# EAGLE schematic io-board-f-d (EAGLE 8.4.3)
AUTHOR: Balazs Racz; DOCUMENT_NUMBER: none; DRAWING_TITLE: OpenLCB IO Board for Nucleo; LICENSE: Licensed by the Solderpad Hardware Lic. V2.0; REVISION: B; YEAR: 2018
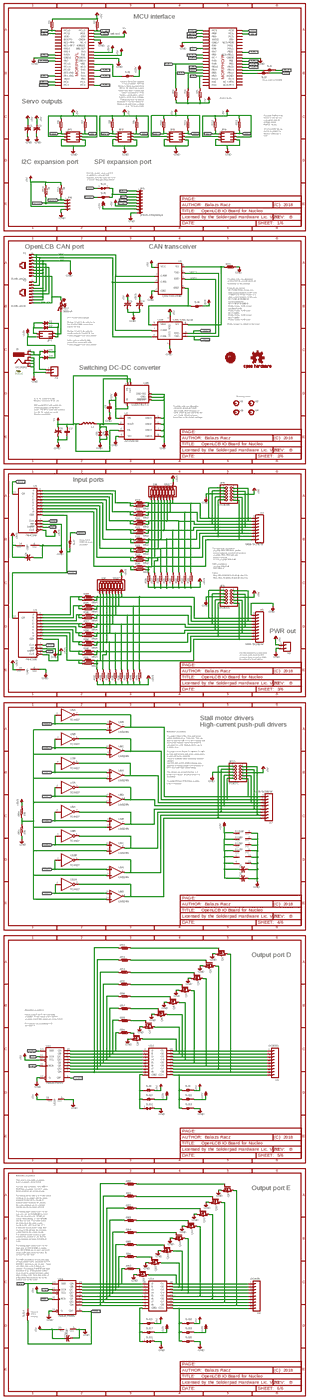
[diagram p0: schematic, sheet 1, overview]
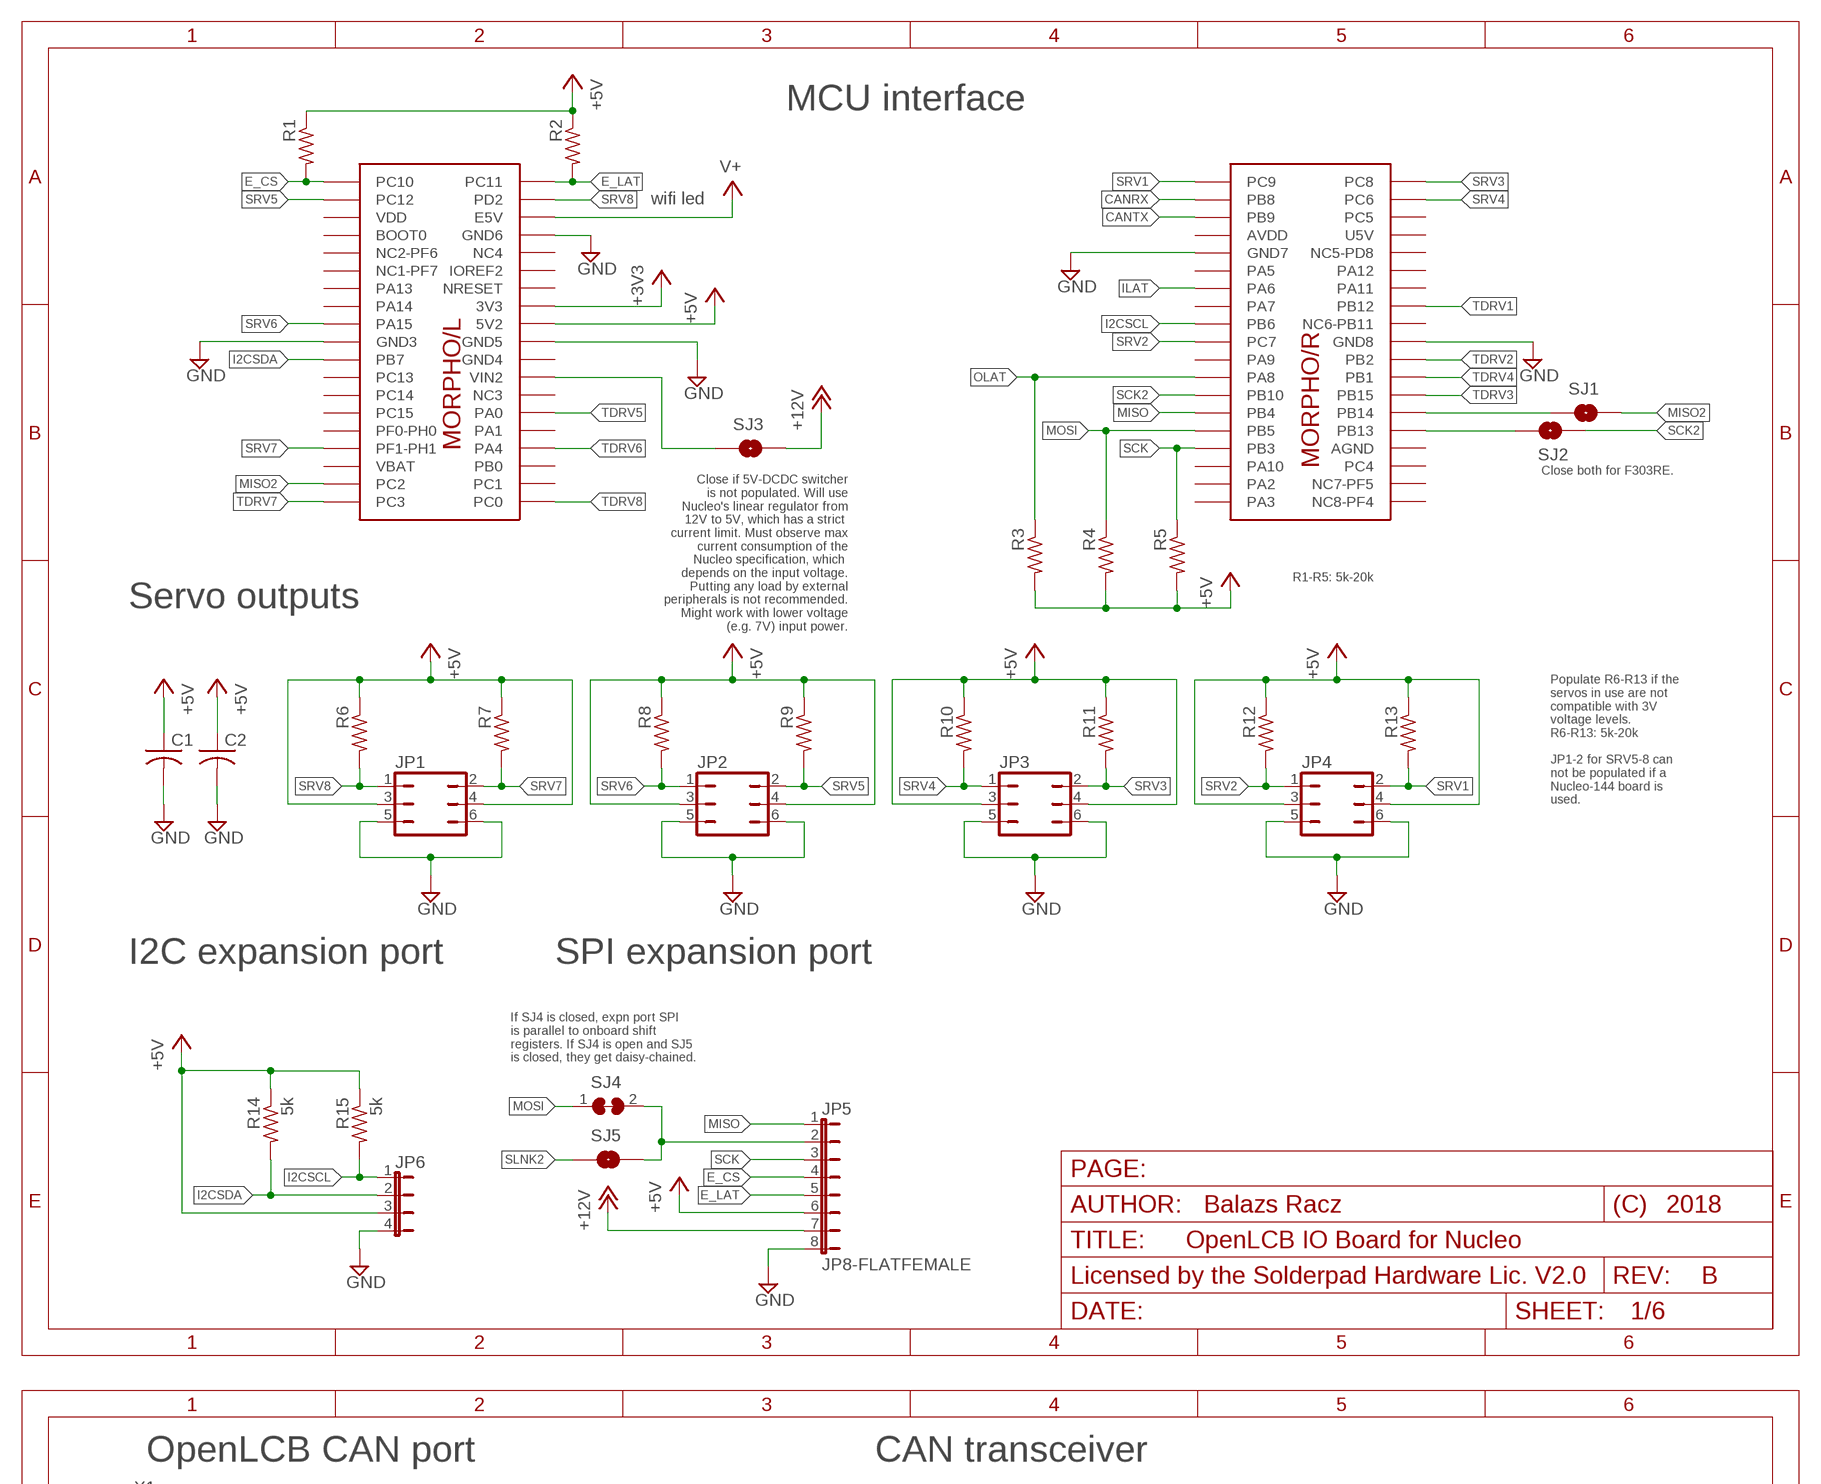
[diagram p1: schematic, sheet 1, part 1 of 4]
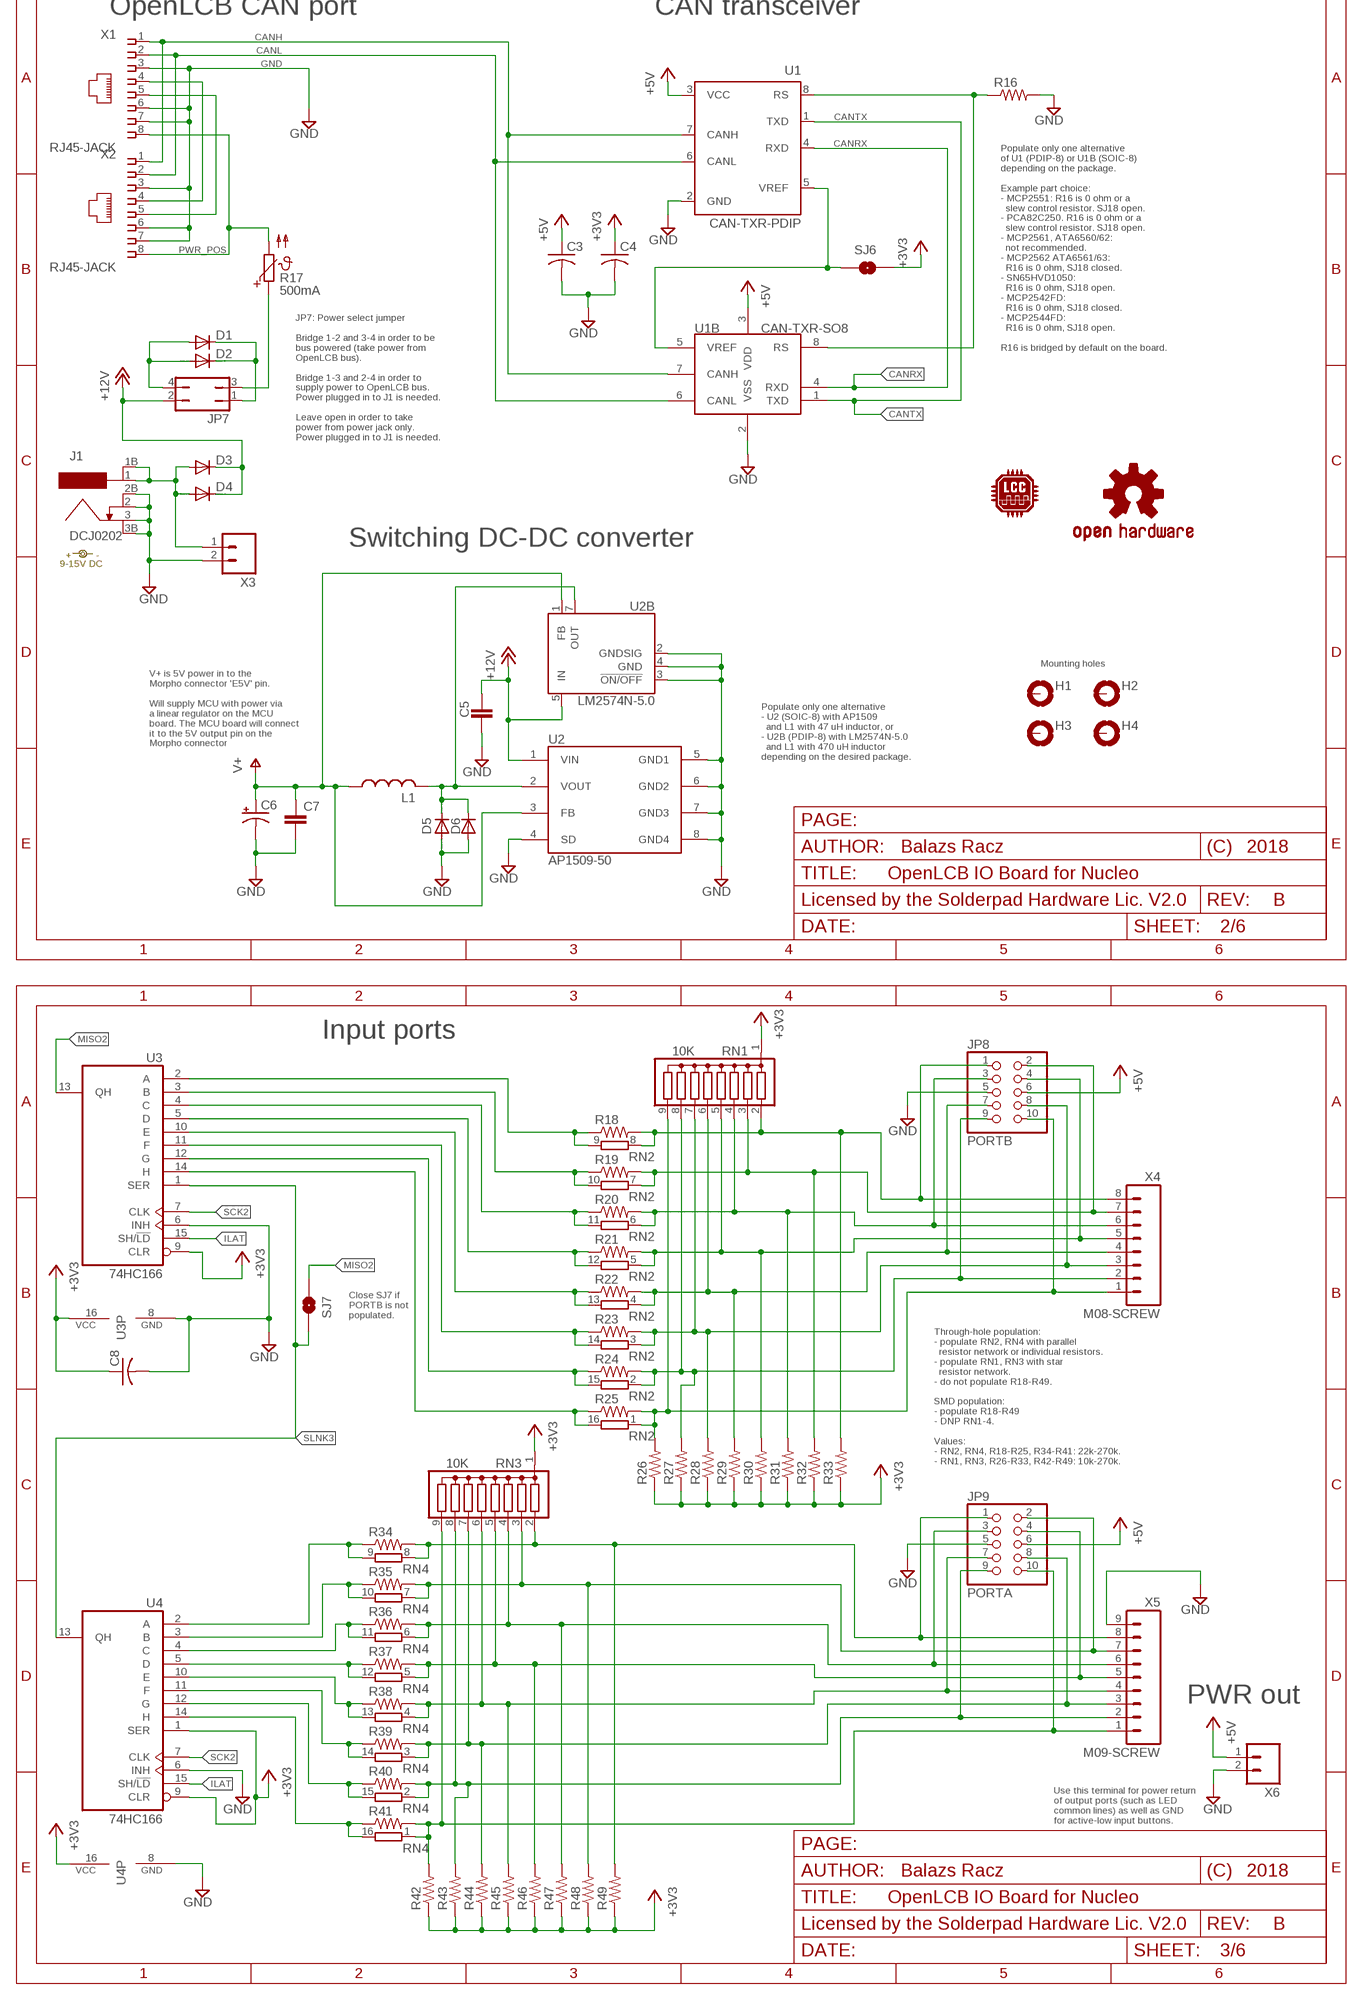
[diagram p2: schematic, sheet 1, part 2 of 4]
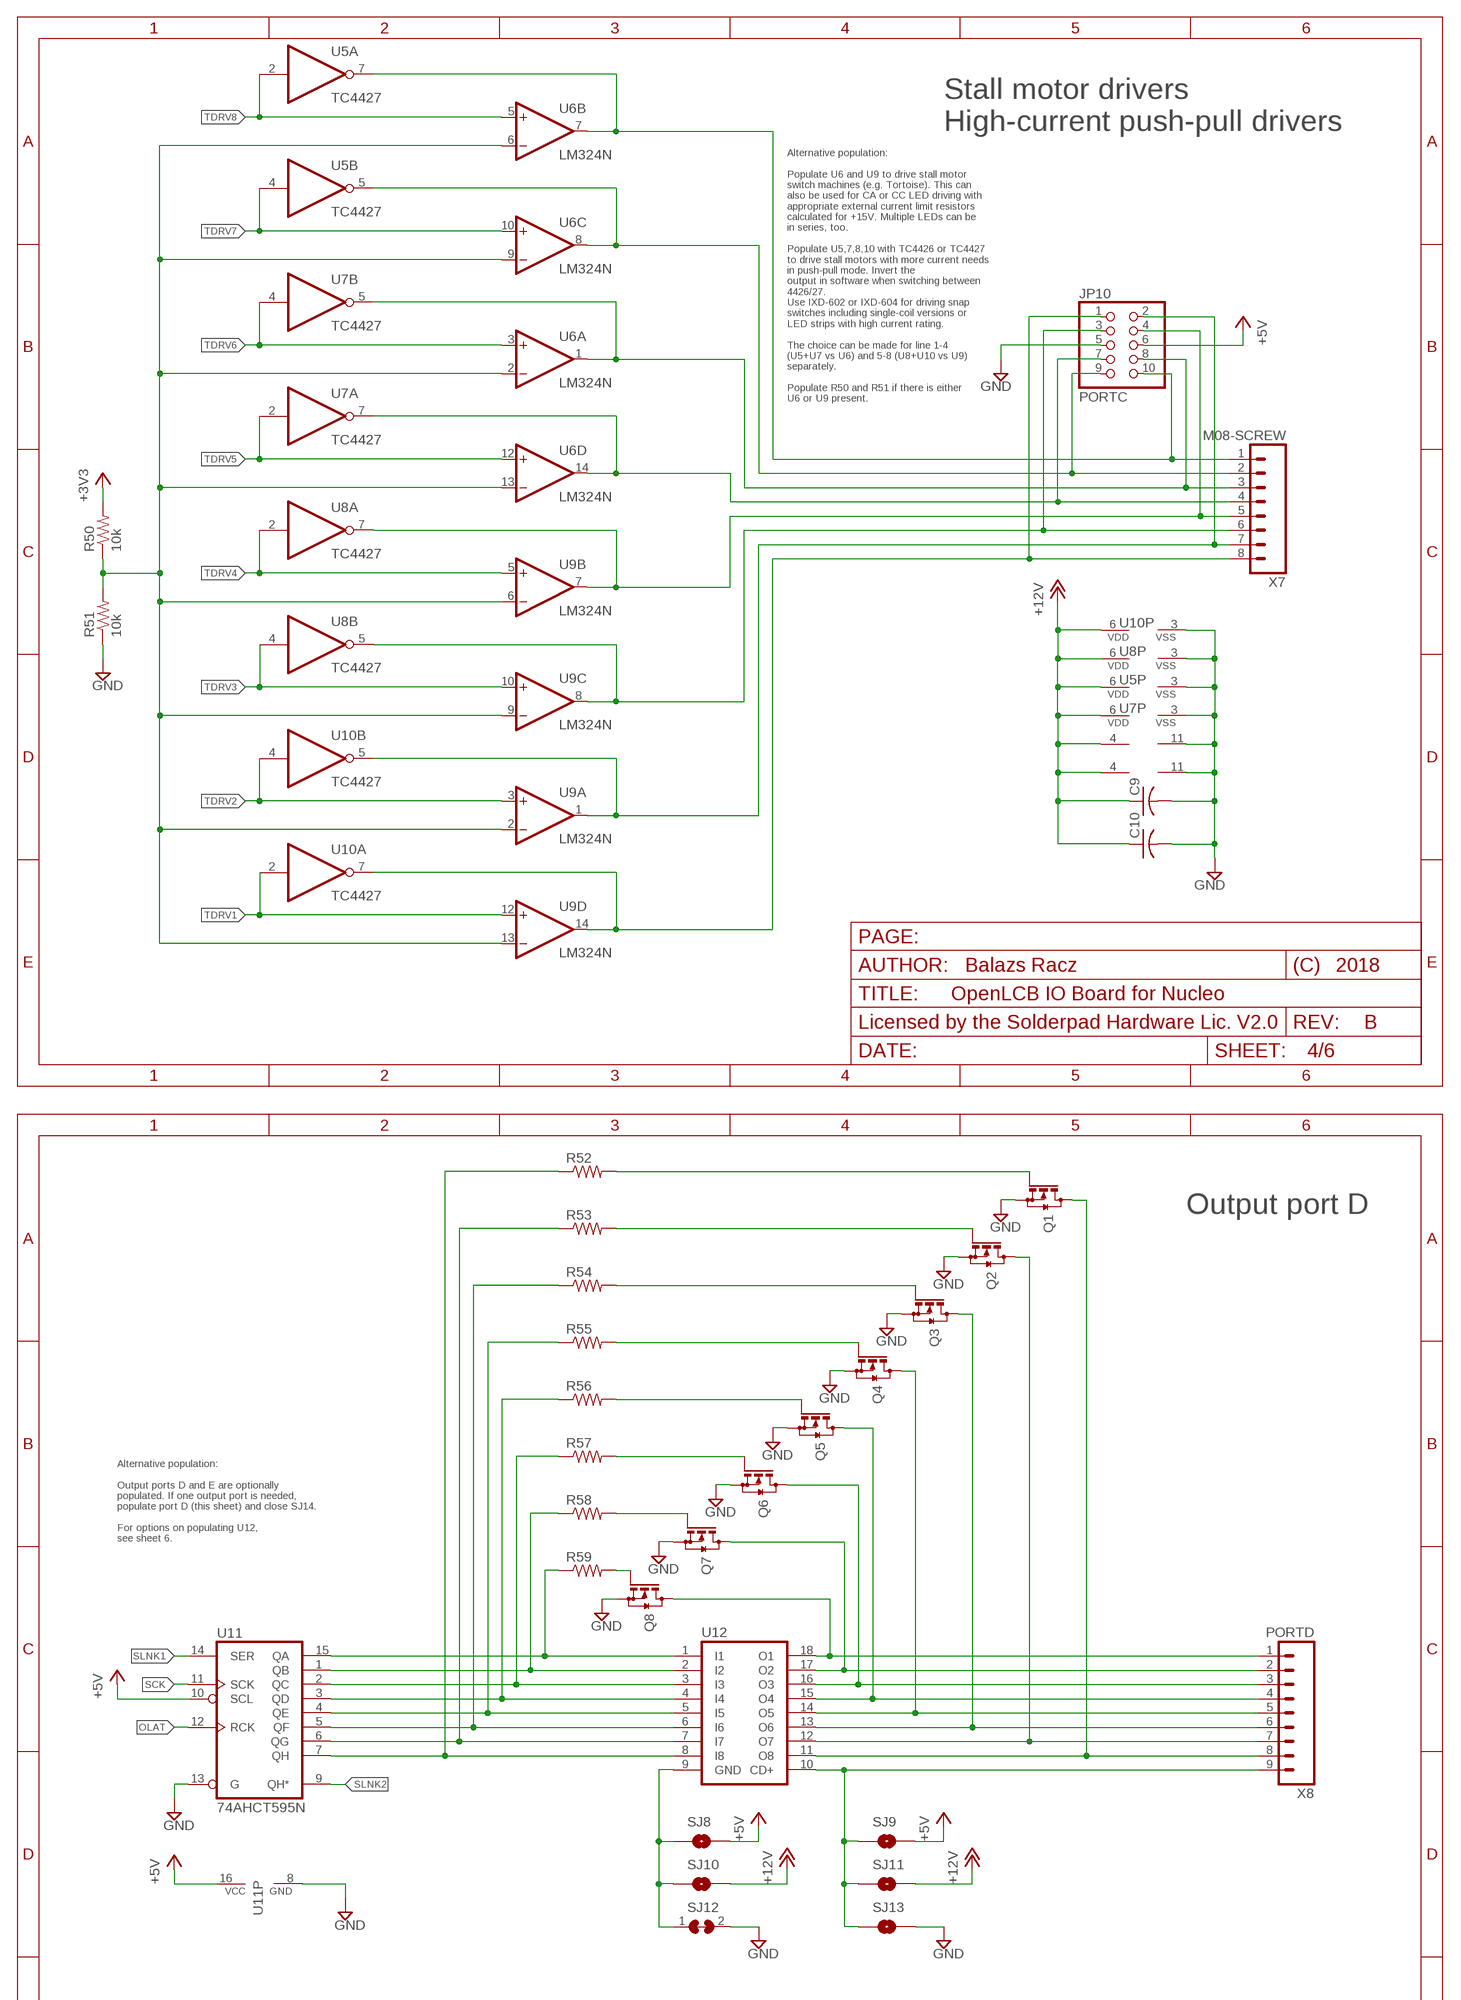
[diagram p3: schematic, sheet 1, part 3 of 4]
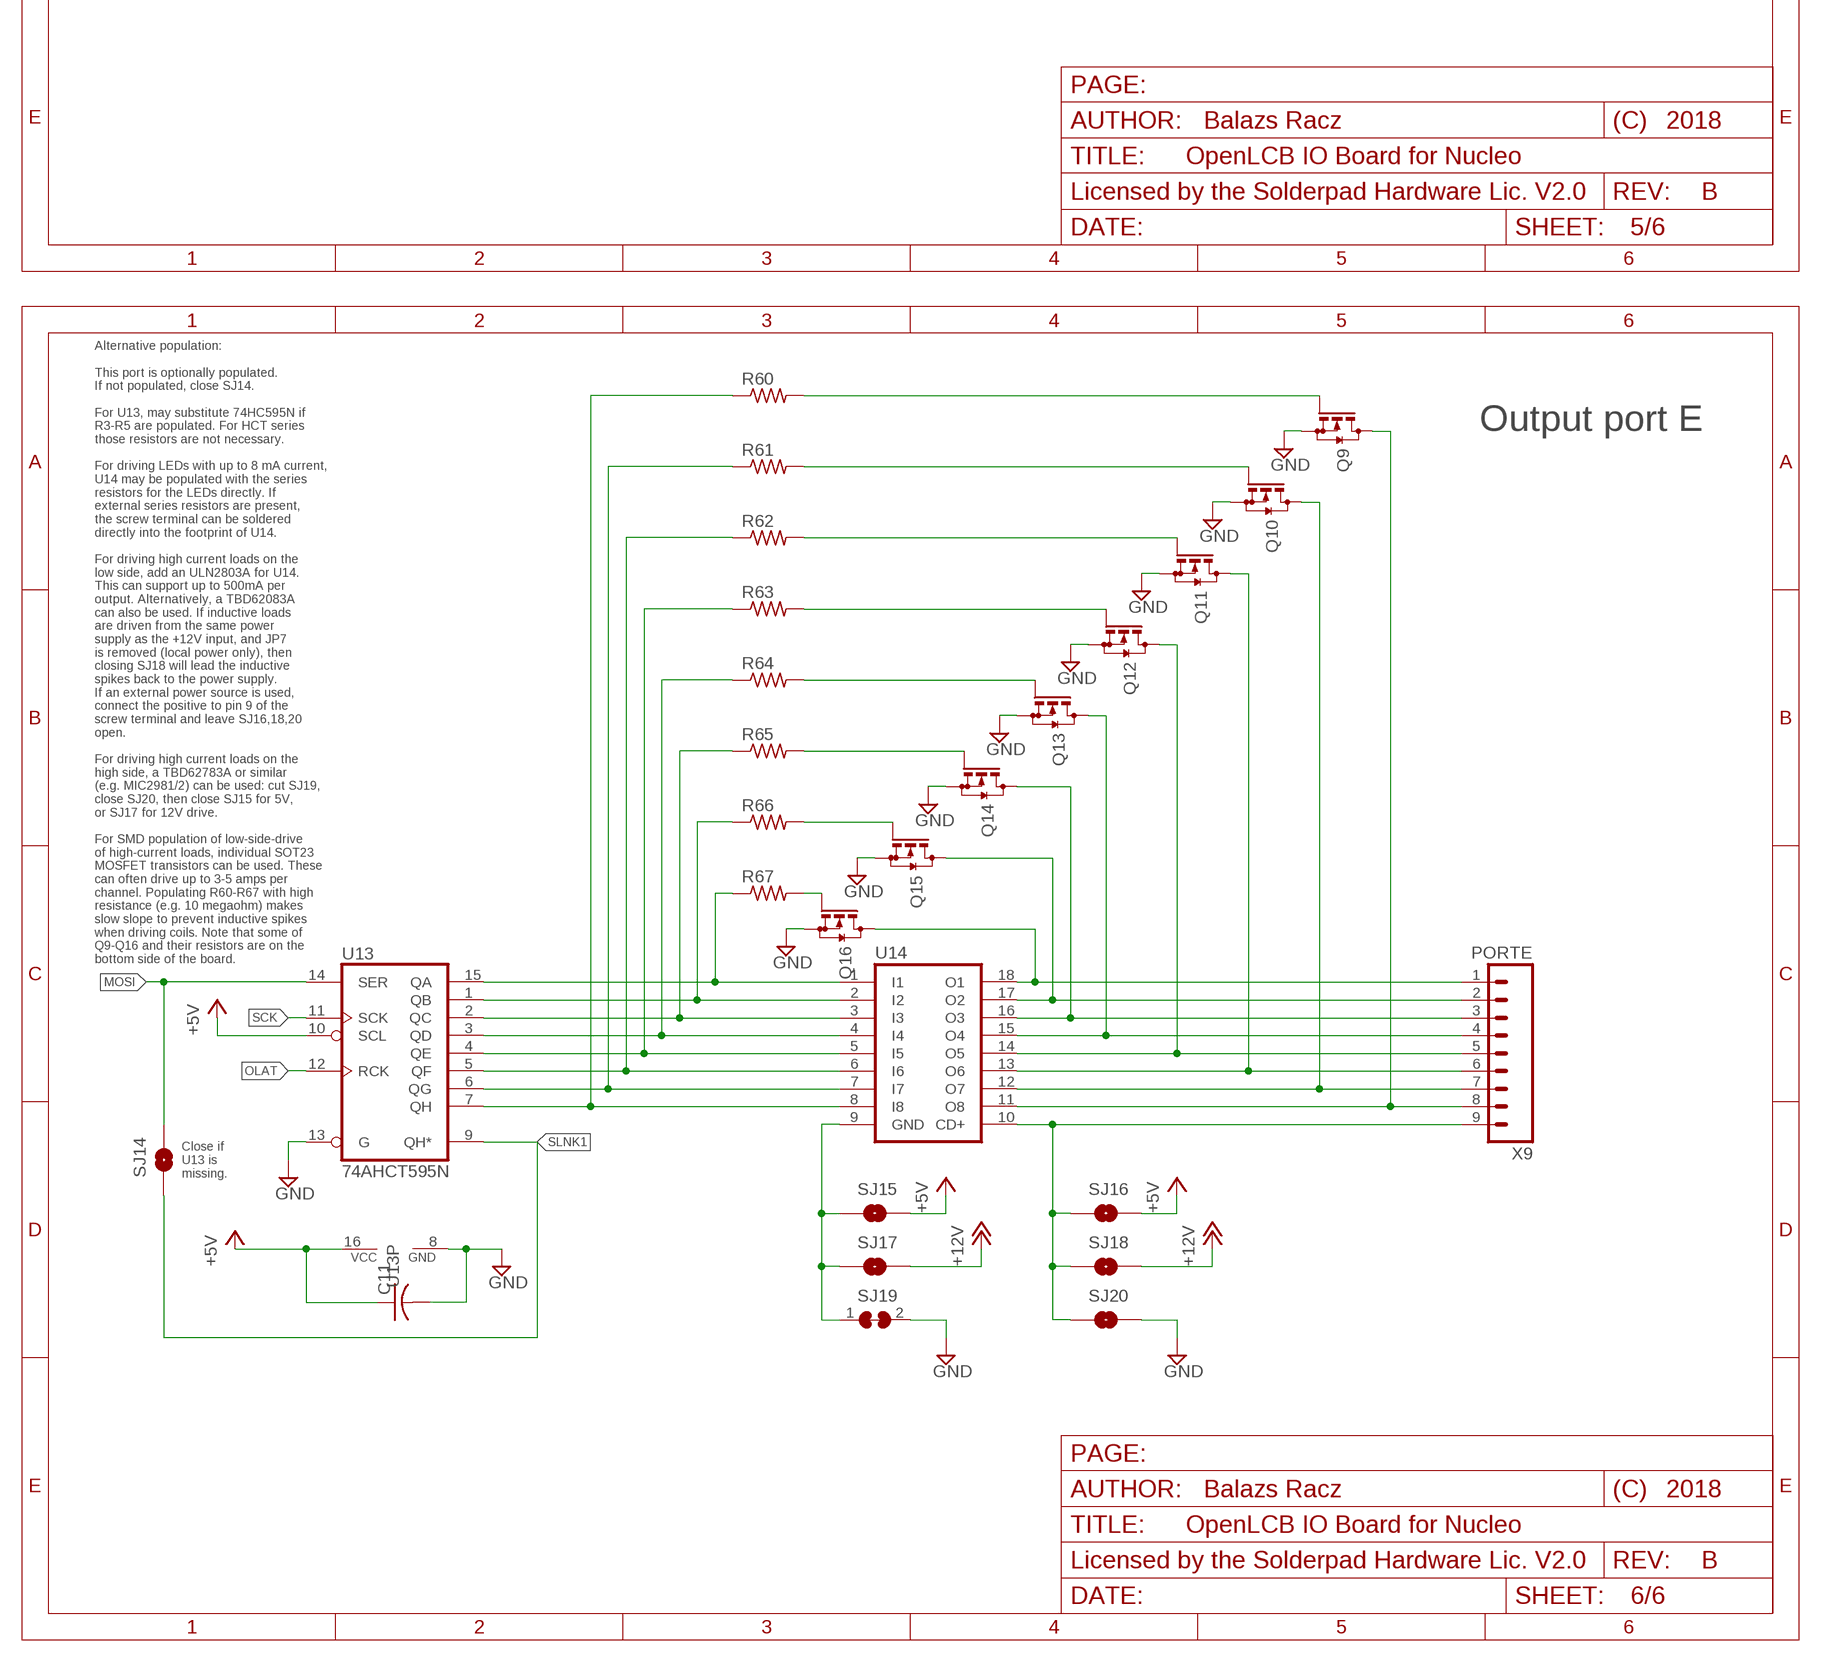
[diagram p4: schematic, sheet 1, part 4 of 4]
FRAME1 (FRAME_A_L): PAGE: MCU interface, servo outputs, expansion port
FRAME2 (FRAME_A_L): PAGE: CAN-bus, power
FRAME3 (FRAME_A_L): PAGE: Input ports
FRAME4 (FRAME_A_L): PAGE: Tortoise drivers and high current drivers
FRAME5 (FRAME_A_L): PAGE: Output port D
FRAME6 (FRAME_A_L): PAGE: Output port E

## Parts
C1  C-USC1206  [C1206]
C2  C-USC1206  [C1206]
C3  C-USC0805  [C0805]
C4  C-USC0805  [C0805]
C5  C-EUC1206  [C1206]
C6  CPOL-USE2.5-5  [E2,5-5]
C7  C-EUC1206  [C1206]
C8  C-USC0805  [C0805]
C9  C-USC1206  [C1206]
C10  C-USC1206  [C1206]
C11  C-USC0805  [C0805]
D1  DIODEDO-214AA-NODOC  [DO214AA-NODOC]
D2  DIODE-DO41-7.6  [DO41-7.6]
D3  DIODEDO-214AA-NODOC  [DO214AA-NODOC]
D4  DIODE-DO41-7.6  [DO41-7.6]
D5  DIODE-DO41-7.6  [DO41-7.6]
D6  DIODEDO-214AA-NODOC  [DO214AA-NODOC]
G1  NUCLEO_64_GENERIC  [NUCLEO_BRD_BASE64]
H1  MOUNT-PAD-ROUND3.3  [3,3-PAD]
H2  MOUNT-PAD-ROUND3.3  [3,3-PAD]
H3  MOUNT-PAD-ROUND3.3  [3,3-PAD]
H4  MOUNT-PAD-ROUND3.3  [3,3-PAD]
J1  DCJ0202  [DCJ0202]
JP1  JP3Q  [JP3Q]
JP2  JP3Q  [JP3Q]
JP3  JP3Q  [JP3Q]
JP4  JP3Q  [JP3Q]
JP5  JP8-FLATFEMALE  [JP8F-FEM]
JP6  JP4-FLAT  [JP4F]
JP7  JP2Q  [JP2Q]
JP8  PORTB  PINHD-2X5CN  [CON10M]
JP9  PORTA  PINHD-2X5CN  [CON10M]
JP10  PORTC  PINHD-2X5CN  [CON10M]
L1  L-US  [L5-8,5]
LG1  LCC_LOGO  [LCC_LOGO]
LOGO1  DOC-OSHW-LOGOM  [OSHW-LOGO-M]
P1  9-15V DC  DOC-POWER_LABEL  [POWER_USAGE]
Q1  BSS123  [SOT23]
Q2  BSS123  [SOT23]
Q3  BSS123  [SOT23]
Q4  BSS123  [SOT23]
Q5  BSS123  [SOT23]
Q6  BSS123  [SOT23]
Q7  BSS123  [SOT23]
Q8  BSS123  [SOT23]
Q9  BSS123  [SOT23]
Q10  BSS123  [SOT23]
Q11  BSS123  [SOT23]
Q12  BSS123  [SOT23]
Q13  BSS123  [SOT23]
Q14  BSS123  [SOT23]
Q15  BSS123  [SOT23]
Q16  BSS123  [SOT23]
R1  R-US_R0805  [R0805]
R2  R-US_R0805  [R0805]
R3  R-US_R0805  [R0805]
R4  R-US_R0805  [R0805]
R5  R-US_R0805  [R0805]
R6  R-US_R0805  [R0805]
R7  R-US_R0805  [R0805]
R8  R-US_R0805  [R0805]
R9  R-US_R0805  [R0805]
R10  R-US_R0805  [R0805]
R11  R-US_R0805  [R0805]
R12  R-US_R0805  [R0805]
R13  R-US_R0805  [R0805]
R14  5k  R-US_R0805  [R0805]
R15  5k  R-US_R0805  [R0805]
R16  R-US_R0805  [R0805]
R17  500mA  PTC_1812  [PTC1812]
R18  R-US_R0603  [R0603]
R19  R-US_R0603  [R0603]
R20  R-US_R0603  [R0603]
R21  R-US_R0603  [R0603]
R22  R-US_R0603  [R0603]
R23  R-US_R0603  [R0603]
R24  R-US_R0603  [R0603]
R25  R-US_R0603  [R0603]
R26  R-US  [R0603]
R27  R-US  [R0603]
R28  R-US  [R0603]
R29  R-US  [R0603]
R30  R-US  [R0603]
R31  R-US  [R0603]
R32  R-US  [R0603]
R33  R-US  [R0603]
R34  R-US_R0603  [R0603]
R35  R-US_R0603  [R0603]
R36  R-US_R0603  [R0603]
R37  R-US_R0603  [R0603]
R38  R-US_R0603  [R0603]
R39  R-US_R0603  [R0603]
R40  R-US_R0603  [R0603]
R41  R-US_R0603  [R0603]
R42  R-US  [R0603]
R43  R-US  [R0603]
R44  R-US  [R0603]
R45  R-US  [R0603]
R46  R-US  [R0603]
R47  R-US  [R0603]
R48  R-US  [R0603]
R49  R-US  [R0603]
R50  10k  R-US_R0805  [R0805]
R51  10k  R-US_R0805  [R0805]
R52  R-US_R0603  [R0603]
R53  R-US_R0603  [R0603]
R54  R-US_R0603  [R0603]
R55  R-US_R0603  [R0603]
R56  R-US_R0603  [R0603]
R57  R-US_R0603  [R0603]
R58  R-US_R0603  [R0603]
R59  R-US_R0603  [R0603]
R60  R-US_R0603  [R0603]
R61  R-US_R0603  [R0603]
R62  R-US_R0603  [R0603]
R63  R-US_R0603  [R0603]
R64  R-US_R0603  [R0603]
R65  R-US_R0603  [R0603]
R66  R-US_R0603  [R0603]
R67  R-US_R0603  [R0603]
RN1  10K  G08R  [SIL9]
RN2  8R-P  [DIL16]
RN3  10K  G08R  [SIL9]
RN4  8R-P  [DIL16]
SJ1  SJRND2  [SJ_RND2]
SJ2  SJRND2  [SJ_RND2]
SJ3  SJRND2  [SJ_RND2]
SJ4  SJ-C  [SJW-C]
SJ5  SJRND2  [SJ_RND2]
SJ6  SJRND2  [SJ_RND2]
SJ7  SJRND2  [SJ_RND2]
SJ8  SJRND2  [SJ_RND2]
SJ9  SJRND2  [SJ_RND2]
SJ10  SJRND2  [SJ_RND2]
SJ11  SJRND2  [SJ_RND2]
SJ12  SJ-C  [SJW-C]
SJ13  SJRND2  [SJ_RND2]
SJ14  SJRND2  [SJ_RND2]
SJ15  SJRND2  [SJ_RND2]
SJ16  SJRND2  [SJ_RND2]
SJ17  SJRND2  [SJ_RND2]
SJ18  SJRND2  [SJ_RND2]
SJ19  SJ-C  [SJW-C]
SJ20  SJRND2  [SJ_RND2]
U1  CAN-TXR-PDIP  PCA82C250  [DIL08]
U1B  CAN-TXR-SO8  MCP2551-SN  [SO-08]
U2  AP1509-50  AP1509  [SO-08]
U2B  LM2574N-5.0  [DIL08]
U3  74HC166  74166N  [DIL16]
U4  74HC166  74166N  [DIL16]
U5  TC4427  TC4426APDIP  [DIL08-LONG]
U6  LM324N  [DIL14]
U7  TC4427  TC4426APDIP  [DIL08-LONG]
U8  TC4427  TC4426APDIP  [DIL08-LONG]
U9  LM324N  [DIL14]
U10  TC4427  TC4426APDIP  [DIL08-LONG]
U11  74AHCT595N  74HCT595N  [DIL16]
U12  ULN2803A  [DIL18-THIN]
U13  74AHCT595N  74HCT595N  [DIL16]
U14  ULN2803A  [DIL18-THIN]
X1  RJ45-JACK  RJ45-JACKRJ45-PULSE-E5J00  [RJ45-PULSE-E5J88]
X2  RJ45-JACK  RJ45-JACKRJ45-PULSE-E5J00  [RJ45-PULSE-E5J88]
X3  CONNECTOR-M023.5MM-LOCK  [SCREWTERMINAL-3.5MM-2_LOCK]
X4  M08-SCREW  [1X08_TERMINAL]
X5  M09-SCREW  [1X09_TERMINAL]
X6  CONNECTOR-M023.5MM-LOCK  [SCREWTERMINAL-3.5MM-2_LOCK]
X7  M08-SCREW  [1X08_TERMINAL]
X8  PORTD  M09-SCREW  [1X09_TERMINAL]
X9  PORTE  M09-SCREW  [1X09_TERMINAL]

## Nets
+3V3: C4.1 C8.1 G1.3V3 R26.1 R27.1 R28.1 R29.1 R30.1 R31.1 R32.1 R33.1 R42.1 R43.1 R44.1 R45.1 R46.1 R47.1 R48.1 R49.1 R50.2 RN1.1 RN3.1 SJ6.P$2 U3.9(CLR) U3.16(VCC) U4.1(SER) U4.9(CLR) U4.16(VCC)
+5V: C1.1 C2.1 C3.1 C11.1 G1.5V2 JP1.3 JP1.4 JP2.3 JP2.4 JP3.3 JP3.4 JP4.3 JP4.4 JP5.6 JP6.3 JP8.6 JP9.6 JP10.6 R1.1 R2.1 R3.2 R4.2 R5.2 R6.1 R7.1 R8.1 R9.1 R10.1 R11.1 R12.1 R13.1 R14.1 R15.1 SJ8.P$2 SJ9.P$2 SJ15.P$2 SJ16.P$2 U1.3(VCC) U1B.3(VDD) U11.10(SCL) U11.16(VCC) U13.10(SCL) U13.16(VCC) X6.1
+12V: C5.1 C9.1 C10.1 D3.C D4.C JP5.7 JP7.2 SJ3.P$2 SJ10.P$2 SJ11.P$2 SJ17.P$2 SJ18.P$2 U2.1(VIN) U2B.5(IN) U5.6(P:VDD) U6.4(P:V+) U7.6(P:VDD) U8.6(P:VDD) U9.4(P:V+) U10.6(P:VDD)
ALT1: X1.4 X2.4
ALT2: X1.5 X2.5
CAN_RS: R16.1 U1.8(RS) U1B.8(RS)
CAN_VIO: SJ6.P$1 U1.5(VREF) U1B.5(VREF)
CANH: U1.7(CANH) U1B.7(CANH) X1.1 X2.1
CANL: U1.6(CANL) U1B.6(CANL) X1.2 X2.2
CANRX: G1.PB8 U1.4(RXD) U1B.4(RXD)
CANTX: G1.PB9 U1.1(TXD) U1B.1(TXD)
CMPREF: R50.1 R51.2 U6.2(A:-IN) U6.6(B:-IN) U6.9(C:-IN) U6.13(D:-IN) U9.2(A:-IN) U9.6(B:-IN) U9.9(C:-IN) U9.13(D:-IN)
E_CS: G1.PC10 JP5.4 R1.2
E_LAT: G1.PC11 JP5.5 R2.2
E_MOSI: JP5.2 SJ4.2 SJ5.P$2
GND: C1.2 C2.2 C3.2 C4.2 C5.2 C6.- C7.2 C8.2 C9.2 C10.2 C11.2 D5.A D6.A G1.GND3 G1.GND5 G1.GND6 G1.GND7 G1.GND8 J1.2 J1.2B J1.3 J1.3B JP1.5 JP1.6 JP2.5 JP2.6 JP3.5 JP3.6 JP4.5 JP4.6 JP5.8 JP6.4 JP8.5 JP9.5 JP10.5 Q1.2(S) Q2.2(S) Q3.2(S) Q4.2(S) Q5.2(S) Q6.2(S) Q7.2(S) Q8.2(S) Q9.2(S) Q10.2(S) Q11.2(S) Q12.2(S) Q13.2(S) Q14.2(S) Q15.2(S) Q16.2(S) R16.2 R51.1 SJ12.2 SJ13.P$2 SJ19.2 SJ20.P$2 U1.2(GND) U1B.2(VSS) U2.4(SD) U2.5(GND1) U2.6(GND2) U2.7(GND3) U2.8(GND4) U2B.2(GNDSIG) U2B.3(!ON/OFF) U2B.4(GND) U3.6(INH) U3.8(GND) U4.6(INH) U4.8(GND) U5.3(P:VSS) U6.11(P:V-) U7.3(P:VSS) U8.3(P:VSS) U9.11(P:V-) U10.3(P:VSS) U11.8(GND) U11.13(G) U13.8(GND) U13.13(G) X1.3 X1.6 X1.7 X2.3 X2.6 X2.7 X3.2 X5.9 X6.2
I2CSCL: G1.PB6 JP6.1 R15.2
I2CSDA: G1.PB7 JP6.2 R14.2
ILAT: G1.PA6 U3.15(SH/!LD) U4.15(SH/!LD)
LPOWA: SJ8.P$1 SJ10.P$1 SJ12.1 U12.9(GND)
LPOWB: SJ9.P$1 SJ11.P$1 SJ13.P$1 U12.10(CD+) X8.9
MISO: G1.PB4 JP5.1
MISO2: G1.PC2 SJ1.P$2 SJ7.P$2 U3.13(QH)
MISO2_ALT: G1.PB14 SJ1.P$1
MOSI: G1.PB5 R4.1 SJ4.1 SJ14.P$2 U13.14(SER)
N$1: R67.1 U13.15(QA) U14.1(I1)
N$2: Q16.3(D) U14.18(O1) X9.1
N$3: R66.1 U13.1(QB) U14.2(I2)
N$4: D3.A D4.A J1.1 J1.1B X3.1
N$5: JP8.10 R25.2 R26.2 RN1.9 RN2.1 X4.1
N$6: JP9.1 R34.2 R49.2 RN3.2 RN4.8 X5.8
N$7: Q15.3(D) U14.17(O2) X9.2
N$8: R65.1 U13.2(QC) U14.3(I3)
N$9: Q14.3(D) U14.16(O3) X9.3
N$10: R64.1 U13.3(QD) U14.4(I4)
N$11: Q13.3(D) U14.15(O4) X9.4
N$12: R63.1 U13.4(QE) U14.5(I5)
N$13: Q12.3(D) U14.14(O5) X9.5
N$14: JP9.2 R35.2 R48.2 RN3.3 RN4.7 X5.7
N$15: JP9.3 R36.2 R47.2 RN3.4 RN4.6 X5.6
N$16: Q13.1(G) R64.2
N$17: R62.1 U13.5(QF) U14.6(I6)
N$18: Q11.3(D) U14.13(O6) X9.6
N$19: JP9.7 R38.2 R45.2 RN3.6 RN4.4 X5.4
N$20: JP9.8 R39.2 R44.2 RN3.7 RN4.3 X5.3
N$21: JP8.3 R20.2 R31.2 RN1.4 RN2.6 X4.6
N$22: JP9.10 R41.2 R42.2 RN3.9 RN4.1 X5.1
N$23: R34.1 RN4.9 U4.2(A)
N$24: R35.1 RN4.10 U4.3(B)
N$25: JP8.1 R18.2 R33.2 RN1.2 RN2.8 X4.8
N$26: JP8.2 R19.2 R32.2 RN1.3 RN2.7 X4.7
N$27: Q12.1(G) R63.2
N$28: JP8.4 R21.2 R30.2 RN1.5 RN2.5 X4.5
N$29: R36.1 RN4.11 U4.4(C)
N$30: R37.1 RN4.12 U4.5(D)
N$31: R38.1 RN4.13 U4.10(E)
N$32: R39.1 RN4.14 U4.11(F)
N$33: JP8.7 R22.2 R29.2 RN1.6 RN2.4 X4.4
N$34: JP8.8 R23.2 R28.2 RN1.7 RN2.3 X4.3
N$35: JP8.9 R24.2 R27.2 RN1.8 RN2.2 X4.2
N$37: R40.1 RN4.15 U4.12(G)
N$38: R41.1 RN4.16 U4.14(H)
N$39: R61.1 U13.6(QG) U14.7(I7)
N$40: Q10.3(D) U14.12(O7) X9.7
N$41: R60.1 U13.7(QH) U14.8(I8)
N$42: Q9.3(D) U14.11(O8) X9.8
N$43: Q11.1(G) R62.2
N$44: R18.1 RN2.9 U3.2(A)
N$45: D1.C D2.C JP7.1
N$46: D1.A D2.A JP7.4
N$47: R19.1 RN2.10 U3.3(B)
N$48: R20.1 RN2.11 U3.4(C)
N$49: R21.1 RN2.12 U3.5(D)
N$50: R22.1 RN2.13 U3.10(E)
N$51: R23.1 RN2.14 U3.11(F)
N$52: R24.1 RN2.15 U3.12(G)
N$53: R25.1 RN2.16 U3.14(H)
N$56: R59.1 U11.15(QA) U12.1(I1)
N$57: JP7.3 R17.1
N$60: G1.VIN2 SJ3.P$1
N$65: Q10.1(G) R61.2
N$75: Q1.3(D) U12.11(O8) X8.8
N$78: Q16.1(G) R67.2
N$79: Q15.1(G) R66.2
N$83: JP9.4 R37.2 R46.2 RN3.5 RN4.5 X5.5
N$84: JP9.9 R40.2 R43.2 RN3.8 RN4.2 X5.2
N$85: Q9.1(G) R60.2
N$87: Q8.3(D) U12.18(O1) X8.1
N$88: Q14.1(G) R65.2
N$89: R58.1 U11.1(QB) U12.2(I2)
N$91: Q7.3(D) U12.17(O2) X8.2
N$92: R57.1 U11.2(QC) U12.3(I3)
N$93: Q6.3(D) U12.16(O3) X8.3
N$94: R56.1 U11.3(QD) U12.4(I4)
N$95: Q5.3(D) U12.15(O4) X8.4
N$96: R55.1 U11.4(QE) U12.5(I5)
N$97: Q4.3(D) U12.14(O5) X8.5
N$98: R54.1 U11.5(QF) U12.6(I6)
N$99: Q3.3(D) U12.13(O6) X8.6
N$100: R53.1 U11.6(QG) U12.7(I7)
N$101: Q2.3(D) U12.12(O7) X8.7
N$102: R52.1 U11.7(QH) U12.8(I8)
N$104: Q8.1(G) R59.2
N$105: Q7.1(G) R58.2
N$106: Q6.1(G) R57.2
N$107: Q5.1(G) R56.2
N$108: Q4.1(G) R55.2
N$109: Q3.1(G) R54.2
N$110: Q2.1(G) R53.2
N$111: Q1.1(G) R52.2
OLAT: G1.PA8 R3.1 U11.12(RCK) U13.12(RCK)
PWR_POS: R17.2 X1.8 X2.8
RPOWA: SJ15.P$1 SJ17.P$1 SJ19.1 U14.9(GND)
RPOWB: SJ16.P$1 SJ18.P$1 SJ20.P$1 U14.10(CD+) X9.9
SCK: G1.PB3 JP5.3 R5.1 U11.11(SCK) U13.11(SCK)
SCK2: G1.PB10 SJ2.P$1 U3.7(CLK) U4.7(CLK)
SCK2_ALT: G1.PB13 SJ2.P$2
SLNK1: SJ14.P$1 U11.14(SER) U13.9(QH*)
SLNK2: SJ5.P$1 U11.9(QH*)
SLNK3: SJ7.P$1 U3.1(SER) U4.13(QH)
SRV1: G1.PC9 JP4.2 R13.2
SRV2: G1.PC7 JP4.1 R12.2
SRV3: G1.PC8 JP3.2 R11.2
SRV4: G1.PC6 JP3.1 R10.2
SRV5: G1.PC12 JP2.2 R9.2
SRV6: G1.PA15 JP2.1 R8.2
SRV7: G1.PF1-PH1 JP1.2 R7.2
SRV8: G1.PD2 JP1.1 R6.2
SW: D5.C D6.C L1.2 U2.2(VOUT) U2B.7(OUT)
TDRV1: G1.PB12 U9.12(D:+IN) U10.2(A:I)
TDRV2: G1.PB2 U9.3(A:+IN) U10.4(B:I)
TDRV3: G1.PB15 U8.4(B:I) U9.10(C:+IN)
TDRV4: G1.PB1 U8.2(A:I) U9.5(B:+IN)
TDRV5: G1.PA0 U6.12(D:+IN) U7.2(A:I)
TDRV6: G1.PA4 U6.3(A:+IN) U7.4(B:I)
TDRV7: G1.PC3 U5.4(B:I) U6.10(C:+IN)
TDRV8: G1.PC0 U5.2(A:I) U6.5(B:+IN)
TOUT1: JP10.10 U5.7(A:O) U6.7(B:OUT) X7.1
TOUT2: JP10.9 U5.5(B:O) U6.8(C:OUT) X7.2
TOUT3: JP10.8 U6.1(A:OUT) U7.5(B:O) X7.3
TOUT4: JP10.7 U6.14(D:OUT) U7.7(A:O) X7.4
TOUT5: JP10.4 U8.7(A:O) U9.7(B:OUT) X7.5
TOUT6: JP10.3 U8.5(B:O) U9.8(C:OUT) X7.6
TOUT7: JP10.2 U9.1(A:OUT) U10.5(B:O) X7.7
TOUT8: JP10.1 U9.14(D:OUT) U10.7(A:O) X7.8
V+: C6.+ C7.1 G1.E5V L1.1 U2.3(FB) U2B.1(FB)
Unconnected: G1.BOOT0 G1.IOREF2 G1.NC1-PF7 G1.NC2-PF6 G1.NC3 G1.NC4 G1.NC5-PD8 G1.NC6-PB11 G1.NC7-PF5 G1.NC8-PF4 G1.NRESET G1.PA1 G1.PA2 G1.PA3 G1.PA5 G1.PA7 G1.PA9 G1.PA10 G1.PA11 G1.PA12 G1.PA13 G1.PA14 G1.PB0 G1.PC1 G1.PC4 G1.PC5 G1.PC13 G1.PC14 G1.PC15 G1.PF0-PH0 H1.B3,3(MOUNT) H2.B3,3(MOUNT) H3.B3,3(MOUNT) H4.B3,3(MOUNT)

## Notes on the sheet
- MCU interface
- wifi led
- Close if 5V-DCDC switcher
  is not populated. Will use
  Nucleo's linear regulator from
  12V to 5V, which has a strict 
  current limit. Must observe max
  current consumption of the
  Nucleo specification, which 
  depends on the input voltage.
  Putting any load by external
  peripherals is not recommended.
  Might work with lower voltage
  (e.g. 7V) input power.
- Close both for F303RE.
- R1-R5: 5k-20k
- Servo outputs
- Populate R6-R13 if the
  servos in use are not
  compatible with 3V
  voltage levels.
  R6-R13: 5k-20k
  
  JP1-2 for SRV5-8 can
  not be populated if a
  Nucleo-144 board is
  used.
- I2C expansion port | SPI expansion port
- If SJ4 is closed, expn port SPI
  is parallel to onboard shift
  registers. If SJ4 is open and SJ5
  is closed, they get daisy-chained.
- OpenLCB CAN port | CAN transceiver
- Populate only one alternative 
  of U1 (PDIP-8) or U1B (SOIC-8) 
  depending on the package.
  
  Example part choice:
  - MCP2551: R16 is 0 ohm or a 
    slew control resistor. SJ18 open.
  - PCA82C250. R16 is 0 ohm or a 
    slew control resistor. SJ18 open.
  - MCP2561, ATA6560/62:
    not recommended.
  - MCP2562 ATA6561/63: 
    R16 is 0 ohm, SJ18 closed.
  - SN65HVD1050: 
    R16 is 0 ohm, SJ18 open.
  - MCP2542FD:
    R16 is 0 ohm, SJ18 closed.
  - MCP2544FD:
    R16 is 0 ohm, SJ18 open.
  
  R16 is bridged by default on the board.
- JP7: Power select jumper
  
  Bridge 1-2 and 3-4 in order to be
  bus powered (take power from 
  OpenLCB bus).
  
  Bridge 1-3 and 2-4 in order to
  supply power to OpenLCB bus.
  Power plugged in to J1 is needed.
  
  Leave open in order to take 
  power from power jack only.
  Power plugged in to J1 is needed.
- Switching DC-DC converter
- Mounting holes
- V+ is 5V power in to the
  Morpho connector 'E5V' pin.
  
  Will supply MCU with power via
  a linear regulator on the MCU 
  board. The MCU board will connect
  it to the 5V output pin on the
  Morpho connector
- Populate only one alternative 
  - U2 (SOIC-8) with AP1509 
    and L1 with 47 uH inductor, or
  - U2B (PDIP-8) with LM2574N-5.0
    and L1 with 470 uH inductor
  depending on the desired package.
- Input ports
- Close SJ7 if
  PORTB is not
  populated.
- Through-hole population:
  - populate RN2, RN4 with parallel
    resistor network or individual resistors.
  - populate RN1, RN3 with star
    resistor network.
  - do not populate R18-R49.
  
  SMD population:
  - populate R18-R49
  - DNP RN1-4.
  
  Values:
  - RN2, RN4, R18-R25, R34-R41: 22k-270k.
  - RN1, RN3, R26-R33, R42-R49: 10k-270k.
- PWR out
- Use this terminal for power return
  of output ports (such as LED
  common lines) as well as GND
  for active-low input buttons.
- Stall motor drivers
  High-current push-pull drivers
- Alternative population:
  
  Populate U6 and U9 to drive stall motor
  switch machines (e.g. Tortoise). This can
  also be used for CA or CC LED driving with
  appropriate external current limit resistors
  calculated for +15V. Multiple LEDs can be
  in series, too.
  
  Populate U5,7,8,10 with TC4426 or TC4427
  to drive stall motors with more current needs
  in push-pull mode. Invert the
  output in software when switching between
  4426/27. 
  Use IXD-602 or IXD-604 for driving snap
  switches including single-coil versions or 
  LED strips with high current rating.
  
  The choice can be made for line 1-4 
  (U5+U7 vs U6) and 5-8 (U8+U10 vs U9)
  separately.
  
  Populate R50 and R51 if there is either
  U6 or U9 present.
- Output port D
- Alternative population:
  
  Output ports D and E are optionally 
  populated. If one output port is needed,
  populate port D (this sheet) and close SJ14.
  
  For options on populating U12,
  see sheet 6.
- Output port E
- Alternative population:
  
  This port is optionally populated.
  If not populated, close SJ14.
  
  For U13, may substitute 74HC595N if
  R3-R5 are populated. For HCT series
  those resistors are not necessary.
  
  For driving LEDs with up to 8 mA current,
  U14 may be populated with the series
  resistors for the LEDs directly. If
  external series resistors are present,
  the screw terminal can be soldered
  directly into the footprint of U14.
  
  For driving high current loads on the
  low side, add an ULN2803A for U14.
  This can support up to 500mA per
  output. Alternatively, a TBD62083A 
  can also be used. If inductive loads
  are driven from the same power 
  supply as the +12V input, and JP7
  is removed (local power only), then
  closing SJ18 will lead the inductive
  spikes back to the power supply.
  If an external power source is used,
  connect the positive to pin 9 of the 
  screw terminal and leave SJ16,18,20
  open.
  
  For driving high current loads on the
  high side, a TBD62783A or similar
  (e.g. MIC2981/2) can be used: cut SJ19, 
  close SJ20, then close SJ15 for 5V, 
  or SJ17 for 12V drive.
  
  For SMD population of low-side-drive
  of high-current loads, individual SOT23
  MOSFET transistors can be used. These
  can often drive up to 3-5 amps per
  channel. Populating R60-R67 with high
  resistance (e.g. 10 megaohm) makes
  slow slope to prevent inductive spikes
  when driving coils. Note that some of
  Q9-Q16 and their resistors are on the
  bottom side of the board.
- Close if
  U13 is
  missing.

## Power pins joined to a net without a drawn wire
AGND: G1.AGND
AVDD: G1.AVDD
GND4: G1.GND4
U5V: G1.U5V
VBAT: G1.VBAT
VDD: G1.VDD

## Library data of the parts
C1-C4 C8-C11 = rcl:C-US: CAPACITOR, American symbol
C5 C7 = rcl:C-EU: CAPACITOR, European symbol
C6 = rcl:CPOL-US: POLARIZED CAPACITOR, American symbol
D1 D3 D6 = trainlib:DIODE
D2 D4 D5 = diode:DIODE-: DIODE
G1 = trainlib:NUCLEO_64_GENERIC
H1-H4 = holes:MOUNT-PAD-ROUND: MOUNTING PAD, round
J1 = trainlib:DCJ0202: DC POWER JACK Source: DCJ0202.pdf; OC_FARNELL: unknown; OC_NEWARK: unknown
JP1-JP4 = trainlib:JP3Q: JUMPER
JP5 = trainlib:JP8-FLAT
JP6 = trainlib:JP4-FLAT: JUMPER
JP7 = trainlib:JP2Q: JUMPER
JP8-JP10 = trainlib:PINHD-2X5: PIN HEADER
L1 = trainlib:L-US
LG1 = tcs:LCC_LOGO: NMRA LCC Logo
LOGO1 = SPCoast:DOC-OSHW-LOGO: Open Source Hardware Logo This logo indicates the piece of hardware it is found on incorporates a OSHW license and/or adheres to the definition of open source hardware found here: http://freedomdefined.org/OSHW Creative Commons - Attribution - ShareAlike 3.0 Creative Commons - Attribution - ShareAlike 3.0 You are free: to Share—to copy, distribute and transmit the work, and to Remix—to adapt the work Under the following conditions: Attribution—You must attribute the work in the manner specified by the author or licensor (but not in any way that suggests that they endorse you or your use of the work.) Share Alike—If you alter, transform, or build upon this work, you may distribute the resulting work only under the same, similar or a compatible license. With the understanding that: Waiver—Any of the above conditions can be waived if you get permission from the copyright holder. Other Rights—In no way are any of the following rights affected by the license: your fair dealing or fair use rights; the author's moral rights; and rights other persons may have either in the work itself or in how the work is used, such as publicity or privacy rights. Notice—For any reuse or distribution, you must make clear to others the license terms of this work. The best way to do that is with a link to http://creativecommons.org/licenses/by-sa/3.0/
P1 = SPCoast:DOC-POWER_LABEL
Q1-Q16 = transistor-small-signal:BSS123: N-CHANNEL MOS FET
R1-R16 R18-R25 R34-R41 R50-R67 = rcl:R-US_: RESISTOR, American symbol
R17 = tcs:PTC_: PHILIPS PTC
R26-R33 R42-R49 = trainlib:R-US
RN1 RN3 = resistor-sil:G08R: SIL RESISTOR; OC_FARNELL: unknown; OC_NEWARK: unknown
RN2 RN4 = resistor-dil:8R-P: DIL RESISTOR; OC_FARNELL: unknown; OC_NEWARK: unknown
SJ1-SJ3 SJ5-SJ11 SJ13-SJ18 SJ20 = trainlib:SJ: SMD solder JUMPER
SJ4 SJ12 SJ19 = trainlib:SJ-C
U1 = trainlib:PCA82C250: CAN CONTROLLER INTERFACE; OC_FARNELL: 3692358; OC_NEWARK: unknown
U1B = SPCoast:MCP2551: MCP2551 High-Speed CAN Transceiver
U2 = trainlib:AP1509
U2B = linear:LM2574?-*: SIMPLE SWITCHER 0.5A Step-Down Voltage Regulator Source: http://cache.national.com/ds/LM/LM2574.pdf
U3 U4 = trainlib:74*166: 8-bit parallel load SHIFT REGISTER
U5 U7 U8 U10 = trainlib:TC4426A: The TC4426A (dual inverter), 4427A (dual buffer) and 4428A (buffer+inverter) are improved buffer/drivers. They will not latch up under any conditions within their power and voltage ratings. They are not subject to damage when up to 5V of noise spiking (of either polarity) occurs on the ground pin. They can accept, without damage or logic upset, up to 500 mA of reverse current (of either polarity) being forced back into their outputs. All terminals are fully protected against up to 4 kV of electrostatic discharge. As MOSFET drivers, the TC4426A/4427A/4428A can easily switch 1000 pF gate capacitances in under 30 ns, and provide low enough impedances in both the ON and OFF states to ensure the MOSFET's intended state will not be affected, even by large transients.
U6 U9 = trainlib:LM324: OP AMP
U11 U13 = trainlib:74*595: 8-bit SHIFT REGISTER, output latch
U12 U14 = trainlib:ULN2803A: DRIVER ARRAY
X1 X2 = trainlib:RJ45-JACK: Mod. Jack, Right Angle, 8 posiotion, 8 contatcs RJ45 Source: GLX-S-88M.pdf
X3 X6 = SPCoast:CONNECTOR-M02: PHOENIX CONNECTOR
X4 X7 = trainlib:M08-SCREW
X5 X8 X9 = trainlib:M09-SCREW